# EAGLE schematic schematicEagle (EAGLE 9.6.2)
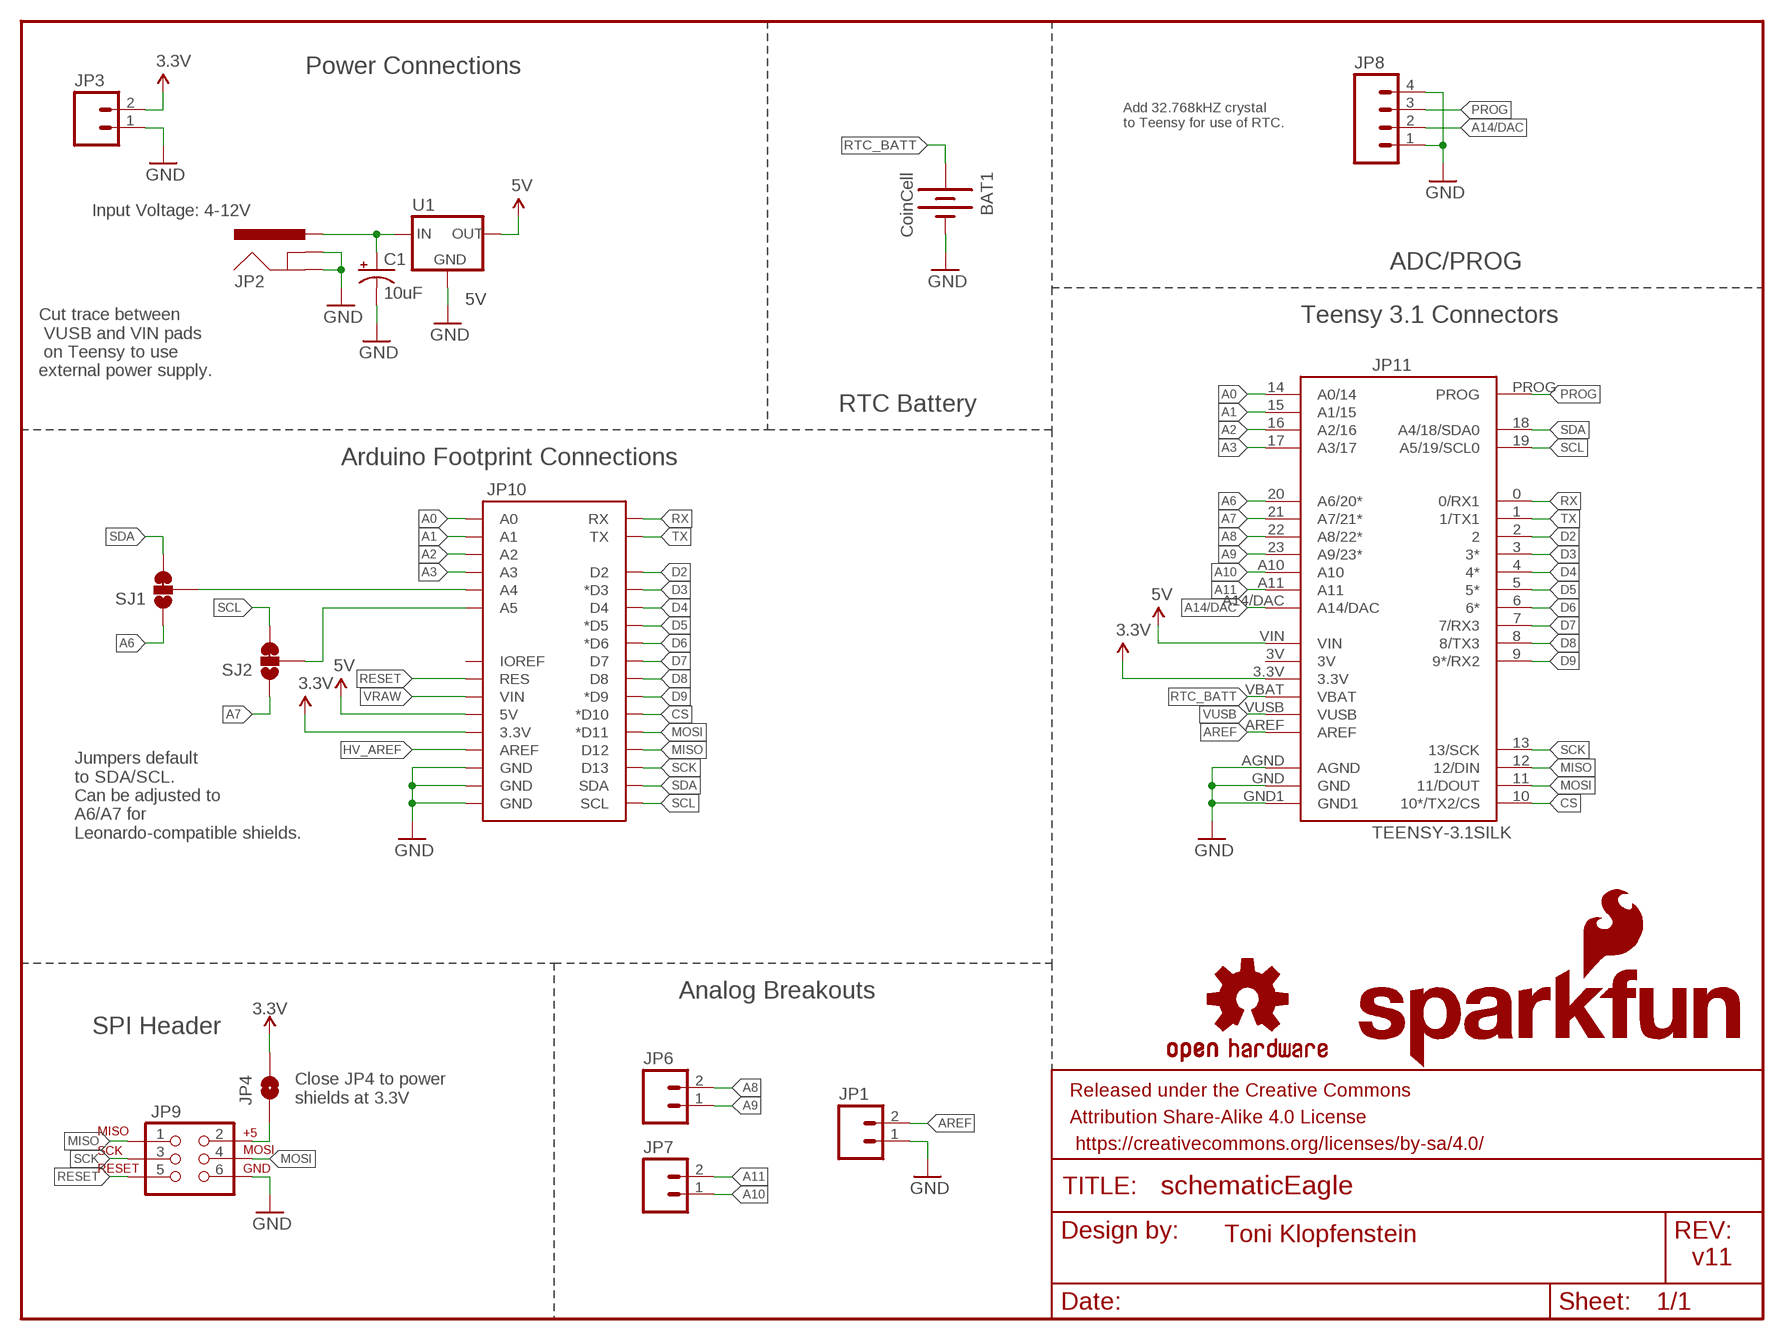
[diagram p0: schematic, sheet 1]

## Parts
BAT1  CoinCell  BATTERY12PTH  [BATTCON_12MM_PTH]
C1  10uF  10UF-25V-20%(PTH)  [CPOL-RADIAL-10UF-25V]
FRAME1  FRAME-LETTER  [CREATIVE_COMMONS]
JP1  M02PTH  [1X02]
JP2  POWER_JACKPTH_LOCK  [POWER_JACK_PTH_LOCK]
JP3  JST2  M02JST-PTH-2  [JST-2-PTH]
JP4  JUMPER-SMT_2_NO_SILK  [SMT-JUMPER_2_NO_SILK]
JP6  M02PTH  [1X02]
JP7  M02PTH  [1X02]
JP8  M04PTH  [1X04]
JP9  AVR_SPI_PRG_6PTH  [2X3]
JP10  ARDUINO_R3_SHIELDUNO_R3_SHIELD_HOLES  [UNO_R3_SHIELD_HOLES]
JP11  TEENSY-3.1SILK  [TEENSY-3.1]
LOGO1  SFE_LOGO_NAME_FLAME.1_INCH  [SFE_LOGO_NAME_FLAME_.1]
LOGO2  OSHW-LOGOM  [OSHW-LOGO-M]
SJ1  JUMPER-PAD-3-2OF3_NC_BY_TRACE_SMALL  [PAD-JUMPER-3-2OF3_NC_BY_TRACE_YES_SILK_FULL_BOX]
SJ2  JUMPER-PAD-3-2OF3_NC_BY_TRACE_SMALL  [PAD-JUMPER-3-2OF3_NC_BY_TRACE_YES_SILK_FULL_BOX]
U1  5V  V_REG_78XX-TO-220  [TO-220-ALT]

## Nets
3.3V: JP3.2 JP4.2 JP10.3.3V JP11.3.3V
5V: JP10.5V JP11.VIN U1.OUT
A0: JP10.A0 JP11.14(A0/14)
A1: JP10.A1 JP11.15(A1/15)
A2: JP10.A2 JP11.16(A2/16)
A3: JP10.A3 JP11.17(A3/17)
A4: JP10.A4 SJ1.2
A5: JP10.A5 SJ2.2
A6: JP11.20(A6/20*) SJ1.1
A7: JP11.21(A7/21*) SJ2.1
A8: JP6.2 JP11.22(A8/22*)
A9: JP6.1 JP11.23(A9/23*)
A10: JP7.1 JP11.A10
A11: JP7.2 JP11.A11
A14/DAC: JP8.2 JP11.A14/DAC
AREF: JP1.2 JP11.AREF
CS: JP10.D10(*D10) JP11.10(10*/TX2/CS)
D2: JP10.D2 JP11.2
D3: JP10.D3(*D3) JP11.3(3*)
D4: JP10.D4 JP11.4(4*)
D5: JP10.D5(*D5) JP11.5(5*)
D6: JP10.D6(*D6) JP11.6(6*)
D7: JP10.D7 JP11.7(7/RX3)
D8: JP10.D8 JP11.8(8/TX3)
D9: JP10.D9(*D9) JP11.9(9*/RX2)
GND: BAT1.GND(-) C1.2(-) JP1.1 JP2.GND JP2.GNDBREAK JP3.1 JP8.1 JP8.4 JP9.6 JP10.GND@0(GND) JP10.GND@1(GND) JP10.GND@2(GND) JP11.AGND JP11.GND JP11.GND1 U1.GND
HV_AREF: JP10.AREF
MISO: JP9.1 JP10.D12 JP11.12(12/DIN)
MOSI: JP9.4 JP10.D11(*D11) JP11.11(11/DOUT)
N$1: JP4.1 JP9.2
PROG: JP8.3 JP11.PROG
RESET: JP9.5 JP10.RES
RTC_BATT: BAT1.VCC@1(+) JP11.VBAT
RX: JP10.RX JP11.0(0/RX1)
SCK: JP9.3 JP10.D13 JP11.13(13/SCK)
SCL: JP10.SCL JP11.19(A5/19/SCL0) SJ2.3
SDA: JP10.SDA JP11.18(A4/18/SDA0) SJ1.3
TX: JP10.TX JP11.1(1/TX1)
VRAW: C1.1(+) JP2.PWR JP10.VIN U1.IN
VUSB: JP11.VUSB
Unconnected: JP10.IOREF JP11.3V

## Notes on the sheet
- Power Connections
- Add 32.768kHZ crystal 
  to Teensy for use of RTC.
- Input Voltage: 4-12V
- ADC/PROG
- Teensy 3.1 Connectors
- Cut trace between
   VUSB and VIN pads
   on Teensy to use 
  external power supply.
- RTC Battery
- Arduino Footprint Connections
- Jumpers default
  to SDA/SCL.
  Can be adjusted to 
  A6/A7 for
  Leonardo-compatible shields.
- Analog Breakouts
- SPI Header
- Close JP4 to power
  shields at 3.3V
- Toni Klopfenstein
- v11

## Library data of the parts
BAT1 = SparkFun-Electromechanical:BATTERY: Battery Holders Various common sizes : AA, AAA, 18650 (PRT-12895), 20mm coin cell and 12mm coin cell. 20MM_4LEGS, BATT-10373; PROD_ID: BATT-08315
C1 = SparkFun-Capacitors:10UF-25V-20%(PTH): CAP-08440; PROD_ID: CAP-08440
FRAME1 = SparkFun-Aesthetics:FRAME-LETTER: Schematic Frame - Letter Standard 8.5x11 US Letter frame
JP1 JP6 JP7 = SparkFun-Connectors:M02: Standard 2-pin 0.1" header. Use with - straight break away headers ( PRT-00116) - right angle break away headers (PRT-00553) - swiss pins (PRT-00743) - machine pins (PRT-00117) - female headers (PRT-00115) Molex polarized connector foot print use with: PRT-08233 with associated crimp pins and housings. 2.54_SCREWTERM for use with PRT-10571. 3.5mm Screw Terminal footprints for PRT-08084 5mm Screw Terminal footprints for use with PRT-08432
JP2 = SparkFun-Connectors:POWER_JACK: Power Jack This is the standard 5.5mm barrel jack for power. The PTH is the most common, proven, reliable, footprint. The Slot footprint only works if the mill layer is transmitted to the PCB fab house so be warned. Mating wall wart : TOL-00298 (and others); PROD_ID: CONN-08197; SF_ID: PRT-00119
JP3 = SparkFun-Connectors:M02: Standard 2-pin 0.1" header. Use with - straight break away headers ( PRT-00116) - right angle break away headers (PRT-00553) - swiss pins (PRT-00743) - machine pins (PRT-00117) - female headers (PRT-00115) Molex polarized connector foot print use with: PRT-08233 with associated crimp pins and housings. 2.54_SCREWTERM for use with PRT-10571. 3.5mm Screw Terminal footprints for PRT-08084 5mm Screw Terminal footprints for use with PRT-08432; PROD_ID: CONN-09863; SKU: PRT-09914
JP4 = SparkFun-Jumpers:JUMPER-SMT_2_NO: Normally open jumper This jumper has two pads in close proximity to each other. Apply solder to close the connection. Round pads are easier to solder for beginners, but are a lot larger. SparkFun Product that uses the round pads: SparkFun EL Sequencer <https://www.sparkfun.com/products/12781>
JP8 = SparkFun-Connectors:M04: Header 4 Standard 4-pin 0.1" header. Use with straight break away headers (SKU : PRT-00116), right angle break away headers (PRT-00553), swiss pins (PRT-00743), machine pins (PRT-00117), and female headers (PRT-00115). Molex polarized connector foot print use with SKU : PRT-08231 with associated crimp pins and housings. 1MM SMD Version SKU: PRT-10208
JP9 = SparkFun-Connectors:AVR_SPI_PRG_6: AVR ISP 6 Pin This is the reduced ISP connector for AVR programming. Common on Arduino. This footprint will take up less PCB space and can be used with a 10-pin to 6-pin adapter such as SKU: BOB-08508 **Special note about "TEST_POINT" package. The stop mask is on the top side, so if you want your programming test points to be on the bottom of your board, make sure to place this package on the bottom side of the board. This also ensure that the orientation to program from the bottom side will be correct.
JP10 = Testing:ARDUINO_R3_SHIELD: Shield form compatible with the Arduino Uno R3.
JP11 = Testing:TEENSY-3.1; SF_ID: DEV-12646
LOGO1 = SparkFun-Aesthetics:SFE_LOGO_NAME_FLAME: SFE Logo, name and flame This is the SparkFun full logo. The logo on the schematic will always be the same size; the package variant is the height of the flame part of the logo. Default layer for the logo on the board is tSilk.
LOGO2 = SparkFun-Aesthetics:OSHW-LOGO: Open Source Hardware Logo This logo indicates the piece of hardware it is found on incorporates a OSHW license and/or adheres to the definition of open source hardware found here: http://freedomdefined.org/OSHW
SJ1 SJ2 = SparkFun-Passives:JUMPER-PAD-3-2OF3_NC_BY_TRACE
U1 = SparkFun-PowerIC:V_REG_78XX: Voltage Regulator Standard 78xx regulator. IGO (Input Ground Output). Spark Fun Electronics SKU : COM-00107; PROD_ID: VREG-08450; SF_ID: COM-00107